# EasyEDA Pro project ProPrj_无线即时通信_2025-03-31.epro, board 电源板
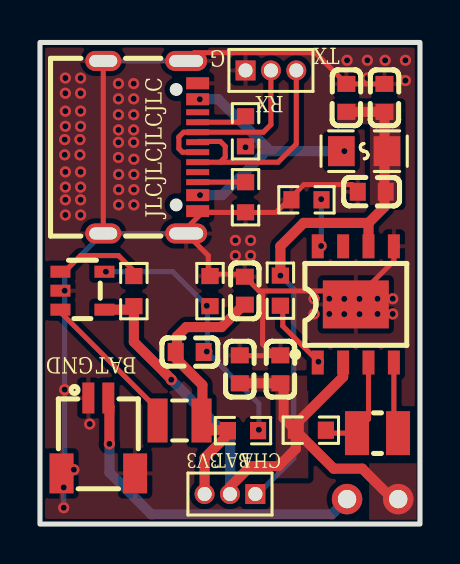
[diagram p4: board, top side]
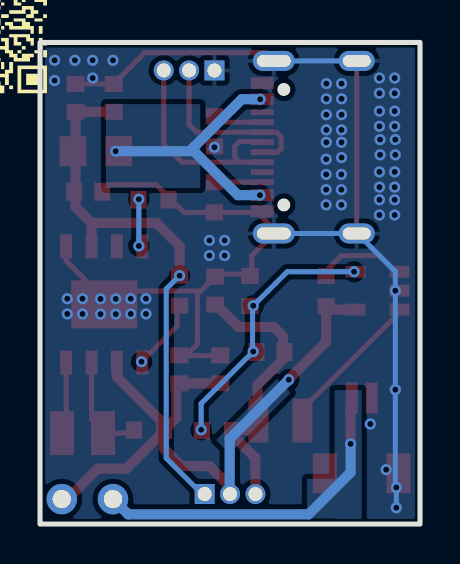
[diagram p5: board, bottom side, seen from below]

Outline 19.02 x 24.11 mm; copper layers: Top Layer, Bottom Layer. Coordinates in mm from the lower left corner of the outline.
Outline path: rectangle 0,24.11 19.02,0
Stack: Top Layer 0.035mm / Dielectric1 0.91mm FR4 er 4.5 / Bottom Layer 0.035mm

## Design rules (mm)
template: JLCPCB Capability(Two Layers Board)
spacing copperThickness1oz (default): track to track 0.102, other pairs 0.152 to 0.3
spacing copperThickness2oz: track to track 0.203, other pairs 0.152 to 0.3
track width copperThickness1oz (default): min 0.127, default 0.254, max 2.54
track width copperThickness2oz: min 0.203, default 0.254, max 2.54
differential pair differentialPair (default): width min 0.127, default 0.254, max 2.54; gap min 0.152, default 0.152
via viaSize (default): diameter min 0.5, default 0.61, max 10; hole min 0.3, default 0.305, max 6.3

## Placement (name value [footprint] x y rotation side)
C32  22uF  [C0603]  17.24 21.34 270 top
C33  22uF  [C0603]  15.33 21.34 270 top
C38  100nF  [C0603]  10 7.75 270 top
C39  100nF  [C0603]  16.6 16.64 0 top
C40  47pF  [C0603]  7.49 8.62 180 top
C41  100nF  [C0603]  10.25 11.68 90 top
C55  47uF  [C0603]  12.03 7.75 270 top
L12  2.2uH  [IND-SMD_L2.5-W2.0_MHCHL2520]  6.98 5.19 0 top
L13  4.7uH  [IND-SMD_L2.5-W2.0]  16.89 4.55 180 top
R1  200mΩ  [R0603]  13.55 4.7 0 top
R43  100kΩ  [R0603]  12.03 11.68 90 top
R44  20kΩ  [R0603]  13.33 16.23 180 top
R45  200k  [R0603]  10.16 4.68 180 top
R46  100k  [R0603]  8.51 11.66 270 top
R47  100kΩ  [R0603]  4.7 11.66 90 top
R58  5.1kΩ  [R0603]  10.29 16.36 270 top
R59  5.1kΩ  [R0603]  10.29 19.66 270 top
U4  ME4059ASPG-N  [ESOP-8_L4.9-W3.9-P1.27-LS6.0-BL-EP]  15.81 11 0 top
U8  SL0805200  [F0805]  16.22 18.67 0 top
U22  ETA3425S2F  [SOT-23-5_L2.9-W1.6-P0.95-LS2.8-BL]  2.12 11.68 270 top
U29  CS-1254R-02  [CONN-SMD_2P-P1.00_CS-1254R-02]  2.92 4.42 0 top
U30  -  [水银开关]  16.64 1.25 90 top
U31  DW127R-11-03-34  [CONN-TH_3P-P1.27_DEALON_DW127R-11-03-34]  9.51 1.5 180 top
U32  DW127R-11-03-34  [CONN-TH_3P-P1.27_DEALON_DW127R-11-03-34]  11.56 22.71 0 top
USB2  TYPE-C16PIN  [USB-C-SMD_TYPE-C16PIN]  5.53 18.87 270 top

## Footprints (pads in the part's own frame, mm; a bottom-side part is the same pattern mirrored in y, then rotated)
C0603
  rect 0.8x0.9 smd: 1(-0.7,0) 2(0.7,0)
CONN-SMD_2P-P1.00_CS-1254R-02
  rect 0.6x1.55 smd: 1(-0.5,1.887) 2(0.5,1.887)
  rect 1.2x2 smd: 3(-1.841,-1.887) 4(1.841,-1.887)
CONN-TH_3P-P1.27_DEALON_DW127R-11-03-34
  rect 1x1 hole 0.7: 1(-1.27,0)
  round 1 hole 0.7: 2(0,0) 3(1.27,0)
ESOP-8_L4.9-W3.9-P1.27-LS6.0-BL-EP
  rect 0.6x1.2 smd: 1(-1.905,-2.909) 2(-0.635,-2.909) 3(0.635,-2.909) 4(1.905,-2.909) 5(1.905,2.909) 6(0.635,2.909) 7(-0.635,2.909) 8(-1.905,2.909)
  rect 3.3x2.4 smd: 9(0,0)
F0805
  rect 1.335x1.5 smd: 1(-1.143,0) 2(1.143,0)
IND-SMD_L2.5-W2.0
  rect 1.2x2.2 smd: 1(1.028,0) 2(-1.028,0)
IND-SMD_L2.5-W2.0_MHCHL2520
  rect 1x2.2 smd: 1(-1.1,0) 2(1.1,0)
R0603
  rect 0.806x0.864 smd: 1(-0.753,0) 2(0.753,0)
SOT-23-5_L2.9-W1.6-P0.95-LS2.8-BL
  rect 0.6x1 smd: 1(-0.95,-1.1) 2(0,-1.1) 3(0.95,-1.1) 4(0.95,1.1) 5(-0.95,1.1)
USB-C-SMD_TYPE-C16PIN
  oval 1x2.1 hole 0.6x1.7: 1(-4.32,1.788) 2(4.32,1.788)
  oval 1x1.8 hole 0.6x1.4: 3(-4.32,-2.362) 4(4.32,-2.362)
  rect 0.6x1.15 smd: A1B12(-3.2,2.362) A4B9(-2.4,2.362) B1A12(3.2,2.362) B4A9(2.4,2.362)
  rect 0.3x1.15 smd: A5(-1.25,2.362) A6(-0.25,2.362) A7(0.25,2.362) A8(-1.75,2.362) B5(1.75,2.362) B6(0.75,2.362) B7(-0.75,2.362) B8(1.25,2.362)
水银开关
  round 1.524 hole 0.914: 1(0,1.27) 2(0,-1.291)

## Nets
3V3: C40.2 C41.1 L12.2 R45.2 U31.3
GND: C32.1 C33.1 C38.1 C39.1 C41.2 C55.1 R44.2 R46.1 R58.2 R59.2 U4.5 U4.9 U22.2 U29.1 U29.3 U29.4 U32.1 USB2.1 USB2.2 USB2.3 USB2.4 USB2.A1B12 USB2.B1A12
VIN: C32.2 C33.2 C39.2 R43.2 U4.6 U8.2 U31.1
VIN1: U8.1 USB2.A4B9 USB2.B4A9
BVIN: U29.2 U30.1
BVIN+: C38.2 C55.2 R1.1 R47.1 U4.2 U22.4 U30.2 U31.2
D+: U32.3 USB2.A6 USB2.B6
D-: U32.2 USB2.A7 USB2.B7
FBK: C40.1 R45.1 R46.2 U22.5
$1N2015: R44.1 U4.8
$1N2017: L13.2 U4.4
$1N2018: L13.1 R1.2 U4.3
$1N2019: R43.1 U4.1
$1N2494: R47.2 U22.1
$1N2496: L12.1 U22.3
$1N3170: R59.1 USB2.A5
$1N3180: R58.1 USB2.B5

Pads without a net: U4 7; USB2 A8 B8

## Via types
v1: diameter 0.559, hole 0.305, Top Layer to Bottom Layer, 80 vias

## Routing (per net, layer and track width the routed paths; a pad name or vN(x,y) marks a point on that pad's centre or on a via; arc(x,y) is an arc through that point)
3V3: length 14
  Top Layer w0.508: U31.3 8.24,3.31 9.41,4.48 9.41,4.7 8.61,4.7 8.13,5.19 8.13,6.96 6.79,8.3 C40.2 6.86,8.68 6.86,9.4 7.32,9.86 9.08,9.86 10.2,10.98 C41.1
GND: length 72.2
  Top Layer w0.254: 15.64,11.67 10.97,11.67 ; 10.97,11.67 11.14,11.5 11.14,9.01 11.72,8.43 9.78,8.43 ; 10.97,11.67 10.13,12.51 8.42,12.51 8.42,13.44 USB2.2 7.32,14.79 8.13,15.6 11.81,15.6 13.21,17 15.61,17 16.09,16.51 ; C32.1 C33.1 13.77,23.6 7.73,23.6 USB2.1 ; USB2.3 USB2.4 ; U4.5 17.71,13.18 15.81,11.27
  Bottom Layer w0.254: 1.14,0.77 v1(1.19,0.82) v1(1.19,1.83) 1.24,1.88 v1(1.24,6.73) v1(1.24,11.68) 1.24,12.65 3.14,14.55 8.08,14.55 ; 8.08,23.19 3.93,23.19
  vias: v1(1.27,22.33) v1(1.27,21.57) v1(1.27,20.67) v1(1.27,19.91) v1(1.24,19.25) v1(1.24,18.49) v1(1.27,17.63) v1(1.27,16.87) v1(1.27,16.23) v1(1.27,15.47) v1(1.7,2.72) v1(2,19.25) v1(2,18.49) v1(2.03,22.33) v1(2.03,21.57) v1(2.03,20.67) v1(2.03,19.91) v1(2.03,17.63) v1(2.03,16.87) v1(2.03,16.23) v1(2.03,15.47) v1(2.49,5.01) v1(3.93,22.05) v1(3.93,21.29) v1(3.93,20.5) v1(3.93,19.73) v1(3.93,19.11) v1(3.93,18.35) v1(3.94,17.51) v1(3.94,16.74) v1(3.94,15.98) v1(4.69,22.05) v1(4.69,21.29) v1(4.69,20.5) v1(4.69,19.73) v1(4.69,19.11) v1(4.7,18.27) v1(4.7,17.51) v1(4.7,16.74) v1(4.7,15.98) v1(9.78,14.2) v1(9.78,13.44) v1(10.29,18.86) v1(10.54,14.2) v1(10.54,13.44) v1(13.72,11.28) v1(13.72,10.52) v1(14.48,11.28) v1(14.48,10.52) v1(15.23,11.27) v1(15.23,10.51) v1(15.37,23.22) v1(15.99,11.27) v1(15.99,10.51) v1(16.38,23.22) v1(16.38,22.33) v1(16.89,11.28) v1(16.89,10.52) v1(17.27,23.22) v1(17.65,11.28) v1(17.65,10.52) v1(18.29,23.22) v1(18.29,22.2)
VIN: length 27.5
  Top Layer w0.508: 16.44,15.08 U4.6 ; 16.44,15.08 17.24,15.88 C32.2 C33.2 ; 16.44,15.08 13.19,15.08 12.03,13.92 v1(12.03,12.44)
  Bottom Layer w0.254: 10.78,1.38 12.7,3.3 12.7,11.77 v1(12.03,12.44)
VIN1: length 12.7
  Bottom Layer w0.508: v1(8,21.27) 8.92,21.27 11.31,18.88 ; 11.31,18.88 11.52,18.67 v1(15.23,18.67) ; 11.31,18.88 11.31,18.67 9.11,16.47 v1(8.01,16.47)
BVIN: length 16.6
  Top Layer w0.508: 3.42,5.93 3.47,5.88 v1(3.47,4.01)
  Bottom Layer w0.508: v1(3.47,4.01) 3.47,2.59 5.57,0.49 14.6,0.49 15.25,1.13 15.25,1.44
BVIN+: length 33.9
  Top Layer w0.508: v1(6.57,7.23) 6.57,7.25 4.7,9.12 4.7,10.65 4.61,10.73 U22.4 ; R1.1 12.19,5.31 12.19,6.89 C55.2 C38.2 ; R1.1 12.8,3.76 11.94,2.9 10.54,2.9 9.51,1.87 U31.2 ; R1.1 12.8,5 15.17,7.37 U4.2 ; U30.2 17.65,1.25 16.13,2.77 14.7,2.77 12.85,4.62 ; 17.55,1.44 17.79,1.44
  Bottom Layer w0.508: v1(6.57,7.23) 9.52,4.27 9.52,1.39 9.51,1.38
D+: length 11.4
  Top Layer w0.254: 9.02,18.12 11.92,18.12 12.83,19.03 U32.3 ; 9.02,18.12 USB2.B6 ; 9.02,18.12 9.27,18.37 9.27,18.91 9.03,19.16 7.93,19.16 USB2.A6
D-: length 9.3
  Top Layer w0.254: U32.2 11.56,20 11.18,19.62 USB2.B7 7.19,19.62 6.95,19.38 6.95,18.8 7.13,18.62 USB2.A7 8.02,18.62
FBK: length 13.1
  Bottom Layer w0.254: v1(3.3,12.63) 6.64,12.63 v1(8.35,10.93) 8.38,10.9 8.38,8.74 8.35,8.71 v1(8.35,8.64) 10.95,6.03 v1(10.95,4.72)
$1N2015: length 2.3
  Bottom Layer w0.254: v1(14.07,16.27) v1(14.07,13.92)
$1N2017: length 3.5
  Top Layer w0.254: U4.4 17.71,4.63
$1N2018: length 5.2
  Top Layer w0.254: U4.3 16.44,5.26 15.74,4.55 14.33,4.55
$1N2019: length 3.5
  Top Layer w0.254: v1(13.94,8.13) 12.15,9.91 12.15,10.93
$1N2494: length 4.1
  Top Layer w0.254: 4.7,12.67 3.93,13.44 2.03,13.44 1.22,12.63
$1N2496: length 7.7
  Top Layer w0.254: 6.14,5.19 6.14,5.49 0.9,10.73
$1N3170: length 2.5
  Top Layer w0.254: 10.26,20.4 9.98,20.12 USB2.A5
$1N3180: length 2.6
  Top Layer w0.254: USB2.B5 10.52,17.12

## Copper pours and planes (outline as drawn; the poured copper is in the pictures)
GND on Top Layer: -2.03,25.38 21.34,25.38 21.34,-0.15 -2.03,-0.15
GND on Bottom Layer: -4.19,25.76 20.19,25.76 20.19,-0.27 -4.19,-0.27
VIN on Top Layer: 14.86,21.06 18.03,21.06 18.03,20.02 14.86,20.02
VIN on Top Layer: 16.51,21.06 18.03,21.06 18.03,15.98 16.51,15.98
VIN1 on Bottom Layer: 10.99,21.02 15.71,21.02 15.71,16.82 10.99,16.82
BVIN on Bottom Layer: 2.92,6.71 4.27,6.71 4.27,0.26 2.92,0.26
BVIN on Bottom Layer: 3.72,2.27 5.66,2.27 5.66,0.28 3.72,0.28
BVIN+ on Top Layer: 11.79,6.67 13.43,6.67 13.43,2.29 11.79,2.29
BVIN+ on Top Layer: 9.6,7.43 13.37,7.43 13.37,6.63 9.6,6.63
BVIN+ on Top Layer: 16.47,3.05 18.85,3.05 18.85,0.21 16.47,0.21
BVIN+ on Bottom Layer: 6.48,7.26 10.21,7.26 10.21,3.52 6.48,3.52

## Text on the board
Top Silkscreen Layer: JLCJLCJLCJLC | 3V3 | BAT | CHA | GND | G | RX | TX
